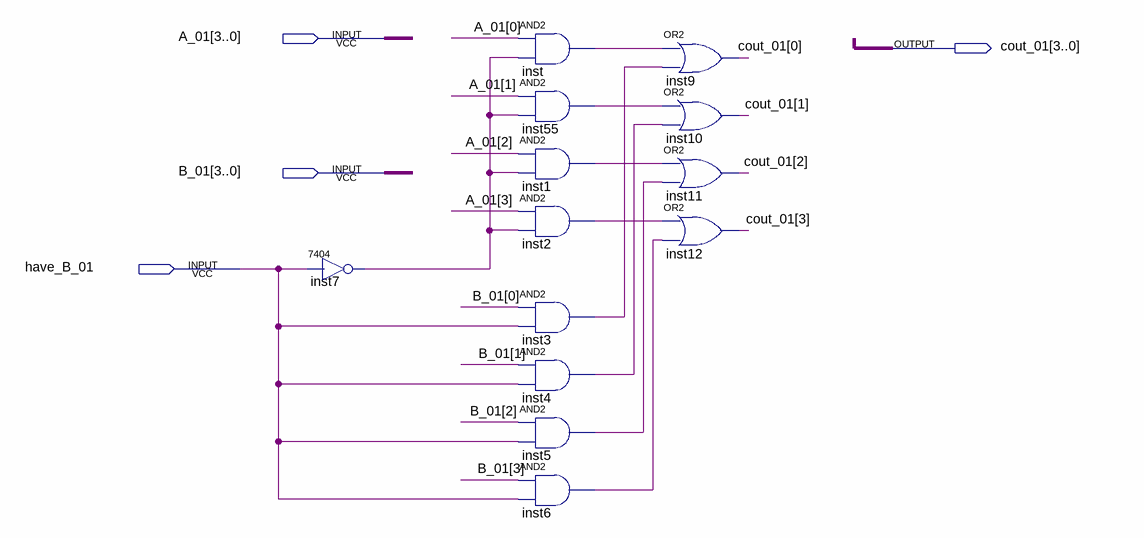
[diagram p0: schematic sheet]
// Quartus schematic pre_cout2.bdf as structural Verilog: 13 symbols, 4 pins
module pre_cout2 (
  input  [3:0] A_01,
  input  [3:0] B_01,
  input  have_B_01,
  output [3:0] cout_01
);

  wire inst1_out, inst2_out, inst3_out, inst4_out, inst5_out, inst6_out, inst7_1, inst55_out, inst_out;

  \7404  inst7 (.\2 (have_B_01), .\1 (inst7_1));
  and inst (inst_out, A_01[0], inst7_1);
  and inst55 (inst55_out, A_01[1], inst7_1);
  and inst1 (inst1_out, A_01[2], inst7_1);
  and inst2 (inst2_out, A_01[3], inst7_1);
  and inst3 (inst3_out, B_01[0], have_B_01);
  and inst4 (inst4_out, B_01[1], have_B_01);
  and inst5 (inst5_out, B_01[2], have_B_01);
  and inst6 (inst6_out, B_01[3], have_B_01);
  or inst9 (cout_01[0], inst_out, inst3_out);
  or inst10 (cout_01[1], inst55_out, inst4_out);
  or inst11 (cout_01[2], inst1_out, inst5_out);
  or inst12 (cout_01[3], inst2_out, inst6_out);
endmodule
